# Altium schematic sheet Connector_Schematic.SchDoc
size B; SheetNumber: 2; SheetTotal: 3
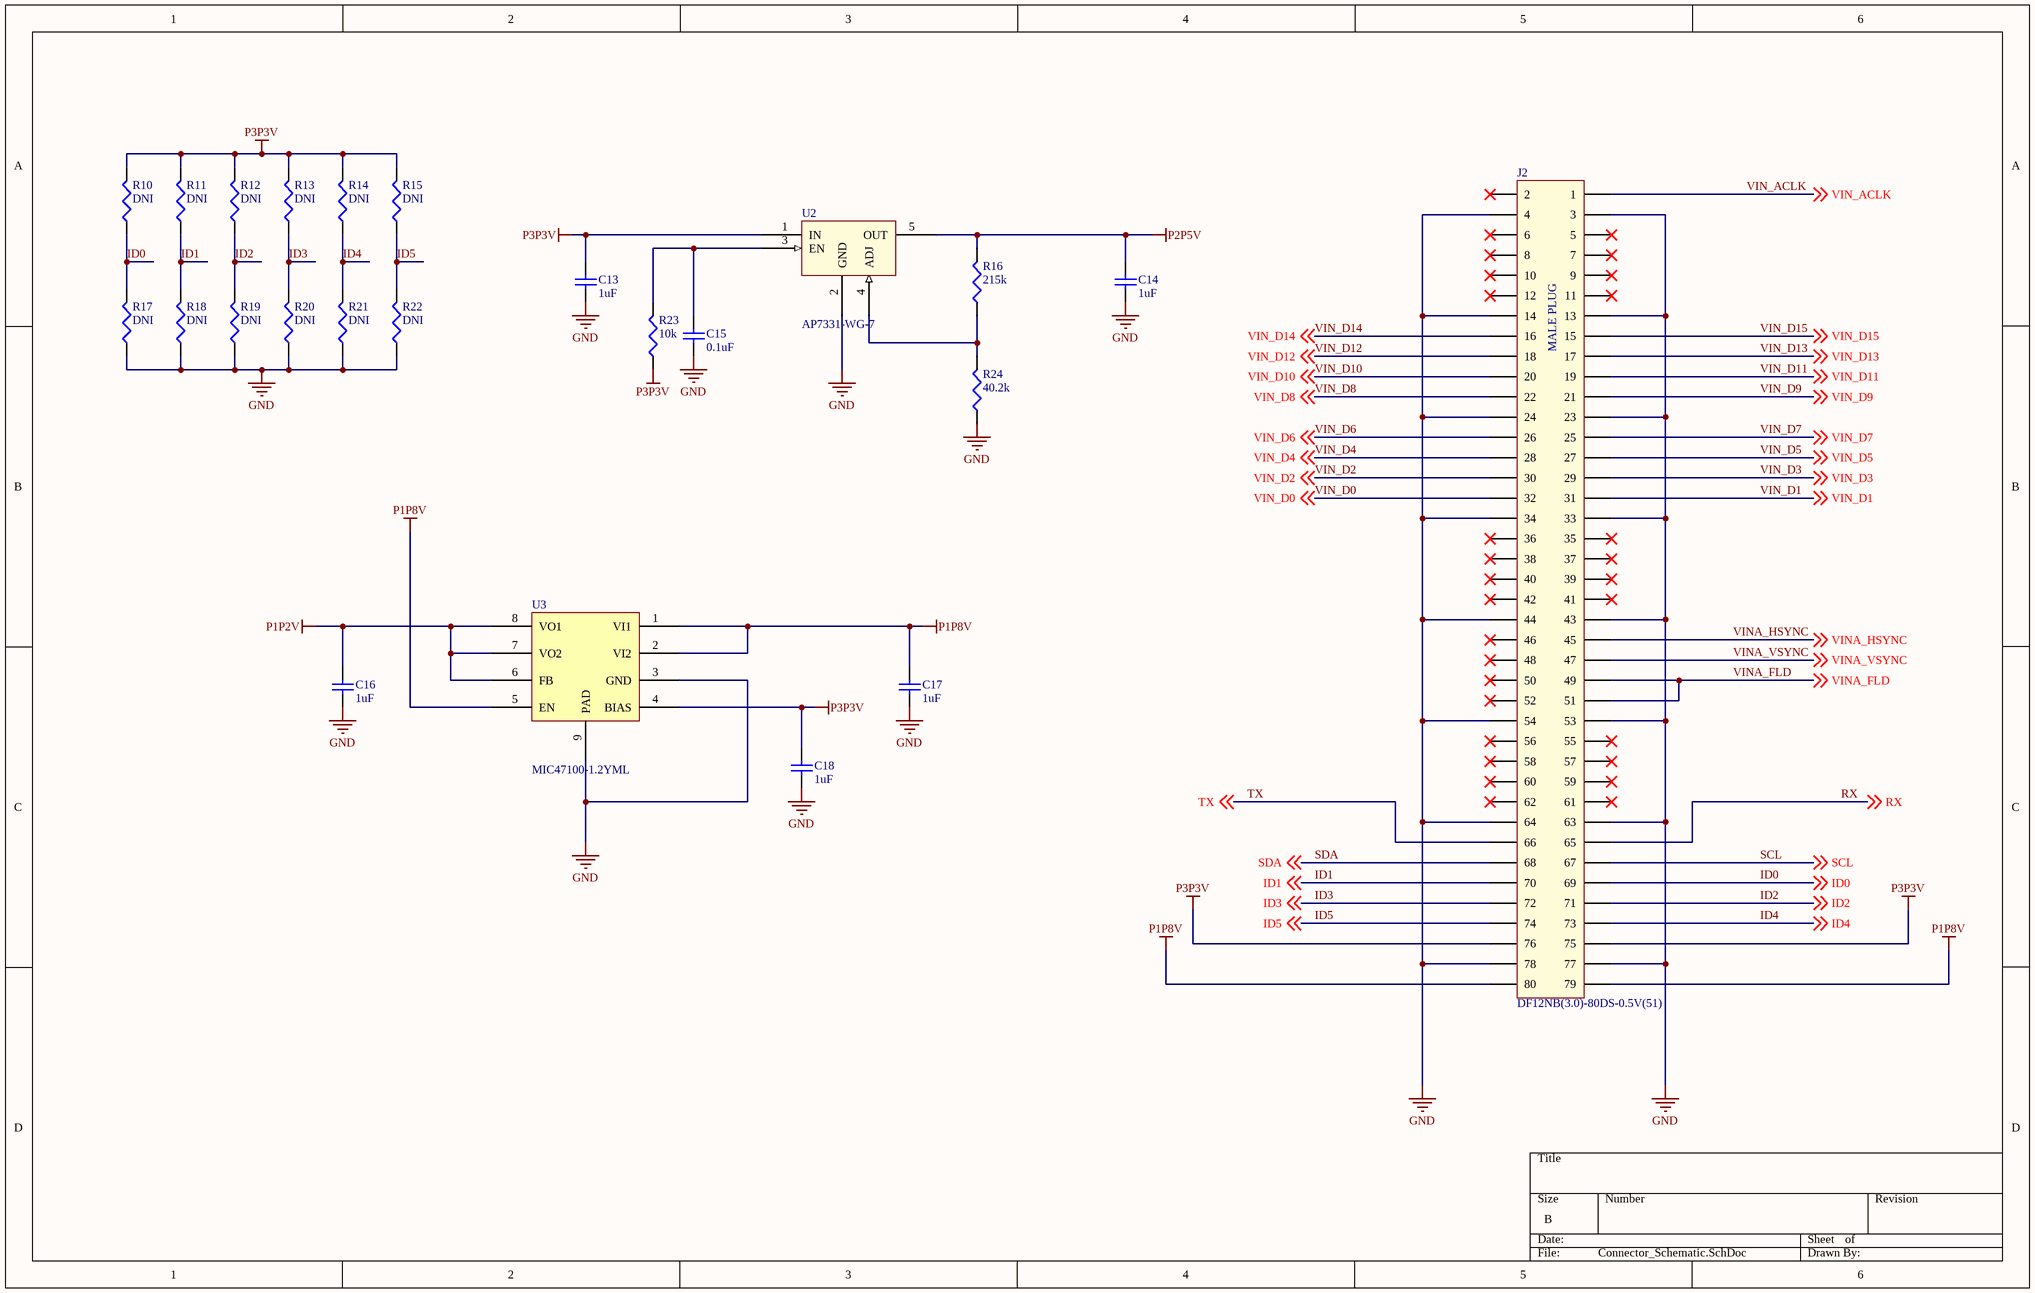
[diagram p0: Connector_Schematic.SchDoc]

## Parts
C13  1uF  [CAP_0402_MED]
C14  1uF  [CAP_0402_MED]
C15  0.1uF  [CAP_0402_MED]
C16  1uF  [CAP_0402_MED]
C17  1uF  [CAP_0402_MED]
C18  1uF  [CAP_0402_MED]
J2  DF12NB(3.0)-80DS-0.5V(51)  [DF12NB(3.0)-80DS-0.5V(51)]
R10  DNI  [RES_0402_MED]
R11  DNI  [RES_0402_MED]
R12  DNI  [RES_0402_MED]
R13  DNI  [RES_0402_MED]
R14  DNI  [RES_0402_MED]
R15  DNI  [RES_0402_MED]
R16  215k  [RES_0402_MED]
R17  DNI  [RES_0402_MED]
R18  DNI  [RES_0402_MED]
R19  DNI  [RES_0402_MED]
R20  DNI  [RES_0402_MED]
R21  DNI  [RES_0402_MED]
R22  DNI  [RES_0402_MED]
R23  10k  [RES_0402_MED]
R24  40.2k  [RES_0402_MED]
U2  AP7331-WG-7  [SOT25-3 (for AP7331-WG-7)]
U3  MIC47100-1.2YML  [MLF2x2]

## Nets
GND: C13.1 C14.1 C15.1 C16.1 C17.1 C18.1 J2.3 J2.4 J2.13 J2.14 J2.23 J2.24 J2.33 J2.34 J2.43 J2.44 J2.53 J2.54 J2.63 J2.64 J2.77 J2.78 R17.1 R18.1 R19.1 R20.1 R21.1 R22.1 R24.1 U2.2(GND) U3.3(GND) U3.9(PAD)
P1P2V: C16.2 U3.6(FB) U3.7(VO2) U3.8(VO1)
P1P8V: C17.2 J2.79 J2.80 U3.1(VI1) U3.2(VI2) U3.5(EN)
P2P5V: C14.2 R16.2 U2.5(OUT)
P3P3V: C13.2 C18.2 J2.75 J2.76 R10.2 R11.2 R12.2 R13.2 R14.2 R15.2 R23.1 U2.1(IN) U3.4(BIAS)
ID0: J2.69 R10.1 R17.2 ; off-sheet ID0
ID1: J2.70 R11.1 R18.2 ; off-sheet ID1
ID2: J2.71 R12.1 R19.2 ; off-sheet ID2
ID3: J2.72 R13.1 R20.2 ; off-sheet ID3
ID4: J2.73 R14.1 R21.2 ; off-sheet ID4
ID5: J2.74 R15.1 R22.2 ; off-sheet ID5
RX: J2.65 ; off-sheet RX
SCL: J2.67 ; off-sheet SCL
SDA: J2.68 ; off-sheet SDA
TX: J2.66 ; off-sheet TX
VIN_ACLK: J2.1 ; off-sheet VIN_ACLK
VIN_D0: J2.32 ; off-sheet VIN_D0
VIN_D1: J2.31 ; off-sheet VIN_D1
VIN_D2: J2.30 ; off-sheet VIN_D2
VIN_D3: J2.29 ; off-sheet VIN_D3
VIN_D4: J2.28 ; off-sheet VIN_D4
VIN_D5: J2.27 ; off-sheet VIN_D5
VIN_D6: J2.26 ; off-sheet VIN_D6
VIN_D7: J2.25 ; off-sheet VIN_D7
VIN_D8: J2.22 ; off-sheet VIN_D8
VIN_D9: J2.21 ; off-sheet VIN_D9
VIN_D10: J2.20 ; off-sheet VIN_D10
VIN_D11: J2.19 ; off-sheet VIN_D11
VIN_D12: J2.18 ; off-sheet VIN_D12
VIN_D13: J2.17 ; off-sheet VIN_D13
VIN_D14: J2.16 ; off-sheet VIN_D14
VIN_D15: J2.15 ; off-sheet VIN_D15
VINA_FLD: J2.49 J2.51 ; off-sheet VINA_FLD
VINA_HSYNC: J2.45 ; off-sheet VINA_HSYNC
VINA_VSYNC: J2.47 ; off-sheet VINA_VSYNC
NetC15_2: C15.2 R23.2 U2.3(EN)
NetR16_1: R16.1 R24.2 U2.4(ADJ)

Not connected (* = marked no-connect by the designer): J2 2* 5* 6* 7* 8* 9* 10* 11* 12* 35* 36* 37* 38* 39* 40* 41* 42* 46* 48* 50* 52* 55* 56* 57* 58* 59* 60* 61* 62*

## Notes on the sheet
- (in symbol CMP-00854-A.1) MALE PLUG

## Library data of the parts
C13 C14 C16-C18 = CMP-00695-A.2: CAP CER 1UF 25V X5R 0402; MfgPartNo: EMK105BJ105KV-F; Mfg: Taiyo Yuden; Type: Ceramic - X5R; Package: 402; Capacitance: 1uF; Component Type: Capacitor
C15 = CMP-00496-A.6: CAP CER 0.1UF 25V X7R 0402; SLA Part No: SL00150; MfgPartNo: C1005X7R1E104K; Mfg: TDK; Type: Ceramic - X7R; Capacitance: 0.1uF; Package: 402
J2 = CMP-00854-A.1: DF12NB(3.0)-80DS-0.5V(51) HIROSE CONN HEADER 80POS 3MM SMD 0.5MM; Gender: Male; Mounting: SMT; HelpURL: https://www.hirose.com/product/download/?distributor=digikey&type=specSheet&lang=en&num=DF12NB(4.0)-20DP-0.5V(51); Mfg: Hirose; MfgPartNo: DF12NB(3.0)-80DS-0.5V(51); Component Type: Connector
R10-R15 R17-R22 = CMP-00432-A.10: Do Not Populate 0402 Res; Package: 402; Resistance: DNI; MfgPartNo: DNI; Mfg: DNI; Value: DNI; Component Type: Resistor
R16 = CMP-00638-A.1: RES SMD 215K OHM 1% 1/16W 0402; MfgPartNo: RC0402FR-07215KL; Mfg: Yageo; Resistance: 215k; Package: 0402
R23 = CMP-00396-A.9: RES SMD 10K OHM 1% 1/10W 0402; SLA Part No: SL00225; MfgPartNo: ERJ-2RKF1002X; Mfg: Panasonic; Package: 402; Resistance: 10k
R24 = CMP-00410-A.9: RES 40.2K OHM 1/10W 1% 0402 SMD; SLA Part No: SL00235; MfgPartNo: ERJ-2RKF4022X; Mfg: Panasonic; Package: 402; Resistance: 40.2k
U2 = CMP-00547-A.3: Adj 0.8-5V Out, 2-6V In, 300mA, AP7331-WG-7 LDO SOT23-5; SLA Part No: SL00740; Mfg: Diodes Inc.; HelpURL: http://www.diodes.com/_files/datasheets/AP7346.pdf; Package: SOT-25-3; MfgPartNo: AP7331-WG-7
U3 = CMP-00239-A.3: 1.2V, 1A, MIC47100-1.2TML IC REG LDO 8MLF; SLA Part No: SL00247; Mfg: Micrel; HelpURL: http://www.micrel.com/_PDF/mic47100.pdf; MfgPartNo: MIC47100-1.2YML; Package: 8-MLF